# EAGLE design DualMonoPSU2 (EAGLE 9.6.2)
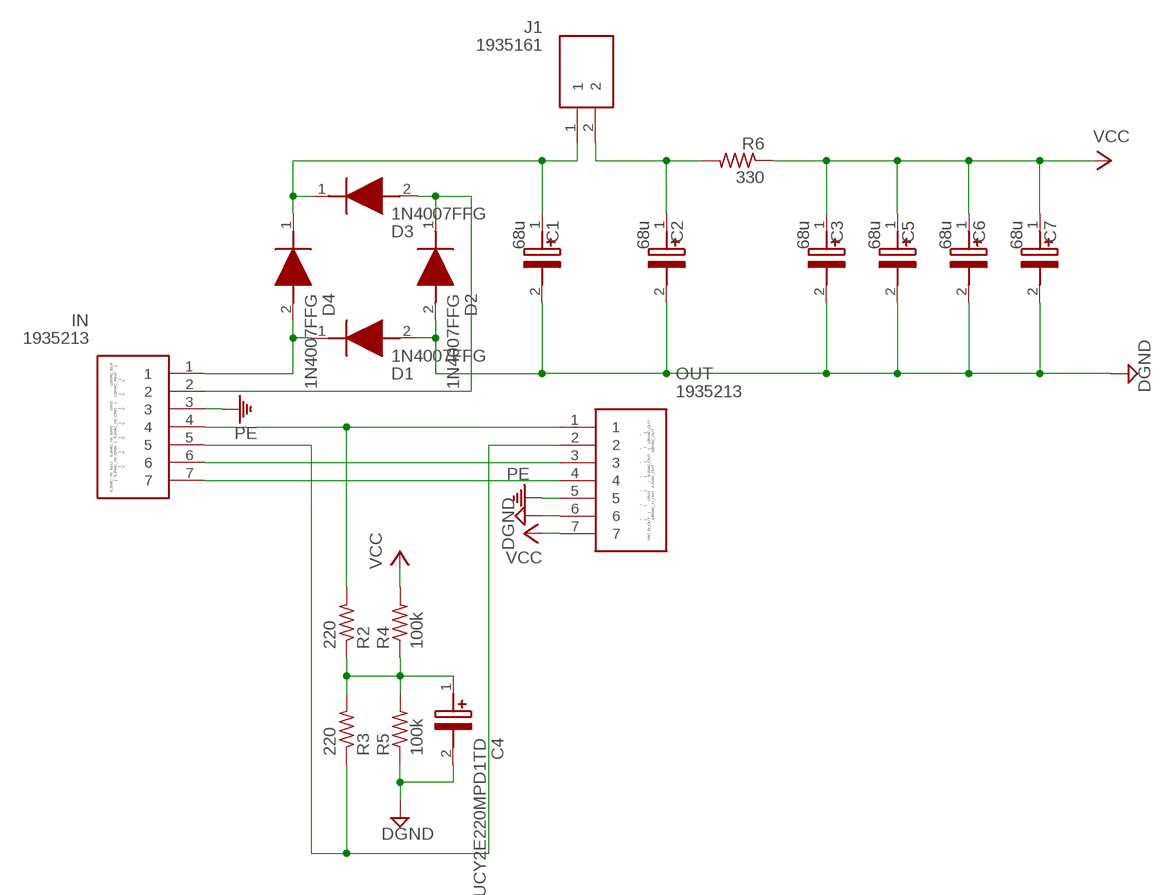
[diagram p0: schematic, sheet 1]

## Parts
C1  68u  500HXW68MEFR14.5X45  [CAPPRD750W80D1475H4700]
C2  68u  500HXW68MEFR14.5X45  [CAPPRD750W80D1475H4700]
C3  68u  500HXW68MEFR14.5X45  [CAPPRD750W80D1475H4700]
C4  UCY2E220MPD1TD  [CAPPRD500W60D1025H1750]
C5  68u  500HXW68MEFR14.5X45  [CAPPRD750W80D1475H4700]
C6  68u  500HXW68MEFR14.5X45  [CAPPRD750W80D1475H4700]
C7  68u  500HXW68MEFR14.5X45  [CAPPRD750W80D1475H4700]
D1  1N4007FFG  [DIOAD1405W86L465D235]
D2  1N4007FFG  [DIOAD1405W86L465D235]
D3  1N4007FFG  [DIOAD1405W86L465D235]
D4  1N4007FFG  [DIOAD1405W86L465D235]
IN  1935213  [1935213]
J1  1935161  [1935161]
OUT  1935213  [1935213]
R2  220  R-US_0411/15  [0411/15]
R3  220  R-US_0411/15  [0411/15]
R4  100k  R-US_0411/15  [0411/15]
R5  100k  R-US_0411/15  [0411/15]
R6  330  R-US_0411/15  [0411/15]

## Nets
DGND: C1.2(-) C2.2(-) C3.2(-) C4.2(-) C5.2(-) C6.2(-) C7.2(-) D1.2(A) D2.2(A) OUT.6 R5.1
N$1: IN.5 OUT.2 R3.1
N$2: D1.1(K) D4.2(A) IN.1
N$3: C1.1(+) D3.1(K) D4.1(K) J1.1
N$4: D2.1(K) D3.2(A) IN.2
N$5: C2.1(+) J1.2 R6.2
N$6: C4.1(+) R2.1 R3.2 R4.1 R5.2
N$7: IN.4 OUT.1 R2.2
N$8: IN.6 OUT.3
N$9: IN.7 OUT.4
PE: IN.3 OUT.5
VCC: C3.1(+) C5.1(+) C6.1(+) C7.1(+) OUT.7 R4.2 R6.1

## Notes on the sheet
- 6.3VAC_IN_BLU     6.3VAC_IN_BRN               GND               115VAC_BLK
          |   6.3VAC_IN_GRN   |   6.3VAC_IN_ORG    |     115VAC_RED      |
          |             |             |             |             |             |             |
         V            V            V            V            V            V           V
- ^             ^            ^            ^            ^            ^            ^
          |             |             |             |             |             |             |
  VAC_N_OUT    |           GND         |    6.3VAC_OUT    |    126VAC_OUT
              240VAC_H_OUT   6.3VAC_OUT            126VAC_OUT

## Library data of the parts
C1-C3 C5-C7 = 500HXW68MEFR14.5X45:500HXW68MEFR14.5X45: Aluminum Electrolytic Capacitors - Radial Leaded GENERAL PURPOSE ELECTROLYTIC CAPACITORS Source: Datasheet <https://www.mouser.com/datasheet/2/977/e_HXW-1600623.pdf>; DESCRIPTION: Aluminum Electrolytic Capacitors - Radial Leaded GENERAL PURPOSE ELECTROLYTIC CAPACITORS; HEIGHT: 47mm; MANUFACTURER_NAME: Rubycon; MANUFACTURER_PART_NUMBER: 500HXW68MEFR14.5X45
C4 = UCY2E220MPD1TD:UCY2E220MPD1TD: Aluminum Electrolytic Capacitors - Radial Leaded 22uF 250V 20% AEC-Q200 Source: Datasheet <https://www.mouser.in/datasheet/2/293/e_ucy-3082387.pdf>; DESCRIPTION: Aluminum Electrolytic Capacitors - Radial Leaded 22uF 250V 20% AEC-Q200; HEIGHT: 17.5mm; MANUFACTURER_NAME: Nichicon; MANUFACTURER_PART_NUMBER: UCY2E220MPD1TD; MOUSER_PART_NUMBER: 647-UCY2E220MPD1TD; MOUSER_PRICE-STOCK: https://www.mouser.co.uk/ProductDetail/Nichicon/UCY2E220MPD1TD?qs=JgOBn5pVFooNXIGMeLbPFg%3D%3D
D1-D4 = 1N4007FFG:1N4007FFG: Rectifiers 1000V 1A Standard Source: Datasheet <http://www.onsemi.com/pub_link/Collateral/1N4001-D.PDF>; DESCRIPTION: Rectifiers 1000V 1A Standard; HEIGHT: mm; MANUFACTURER_NAME: onsemi; MANUFACTURER_PART_NUMBER: 1N4007FFG; MOUSER_PART_NUMBER: 863-1N4007FFG; MOUSER_PRICE-STOCK: https://www.mouser.co.uk/ProductDetail/onsemi/1N4007FFG?qs=y2kkmE52mdPFE87Rxbyfgw%3D%3D
IN OUT = 1935213:1935213: Fixed Terminal Blocks PT 1.5/7-5.0-H Source: Datasheet <https://datasheet.datasheetarchive.com/originals/distributors/SFDatasheet-2/sf-00057464.pdf>; DESCRIPTION: Fixed Terminal Blocks PT 1.5/7-5.0-H; HEIGHT: 11.55mm; MANUFACTURER_NAME: Phoenix Contact; MANUFACTURER_PART_NUMBER: 1935213; MOUSER_PART_NUMBER: 651-1935213; MOUSER_PRICE-STOCK: https://www.mouser.co.uk/ProductDetail/Phoenix-Contact/1935213?qs=wd%252Bw3mUqFrnK4kINj%2Fk1Qg%3D%3D
J1 = 1935161:1935161: Phoenix Contact COMBICON PT PCB Terminal Block, 2 Way/Pole, Screw Terminals, 26 14 AWG Through Hole, Nylon Source: Datasheet <https://datasheet.datasheetarchive.com/originals/distributors/SFDatasheet-2/sf-00057459.pdf>; DESCRIPTION: Phoenix Contact COMBICON PT PCB Terminal Block, 2 Way/Pole, Screw Terminals, 26 14 AWG Through Hole, Nylon; HEIGHT: 11.55mm; MANUFACTURER_NAME: Phoenix Contact; MANUFACTURER_PART_NUMBER: 1935161; MOUSER_PART_NUMBER: 651-1935161; MOUSER_PRICE-STOCK: https://www.mouser.co.uk/ProductDetail/Phoenix-Contact/1935161?qs=W3wJikR1%252BS6eKzfFl8Rbew%3D%3D
R2-R6 = rcl:R-US_: RESISTOR, American symbol; SPICEPREFIX: R

## Net classes
3 Power: width 1.27 mm, drill 1.27 mm, clearance 0.254 mm

## Board
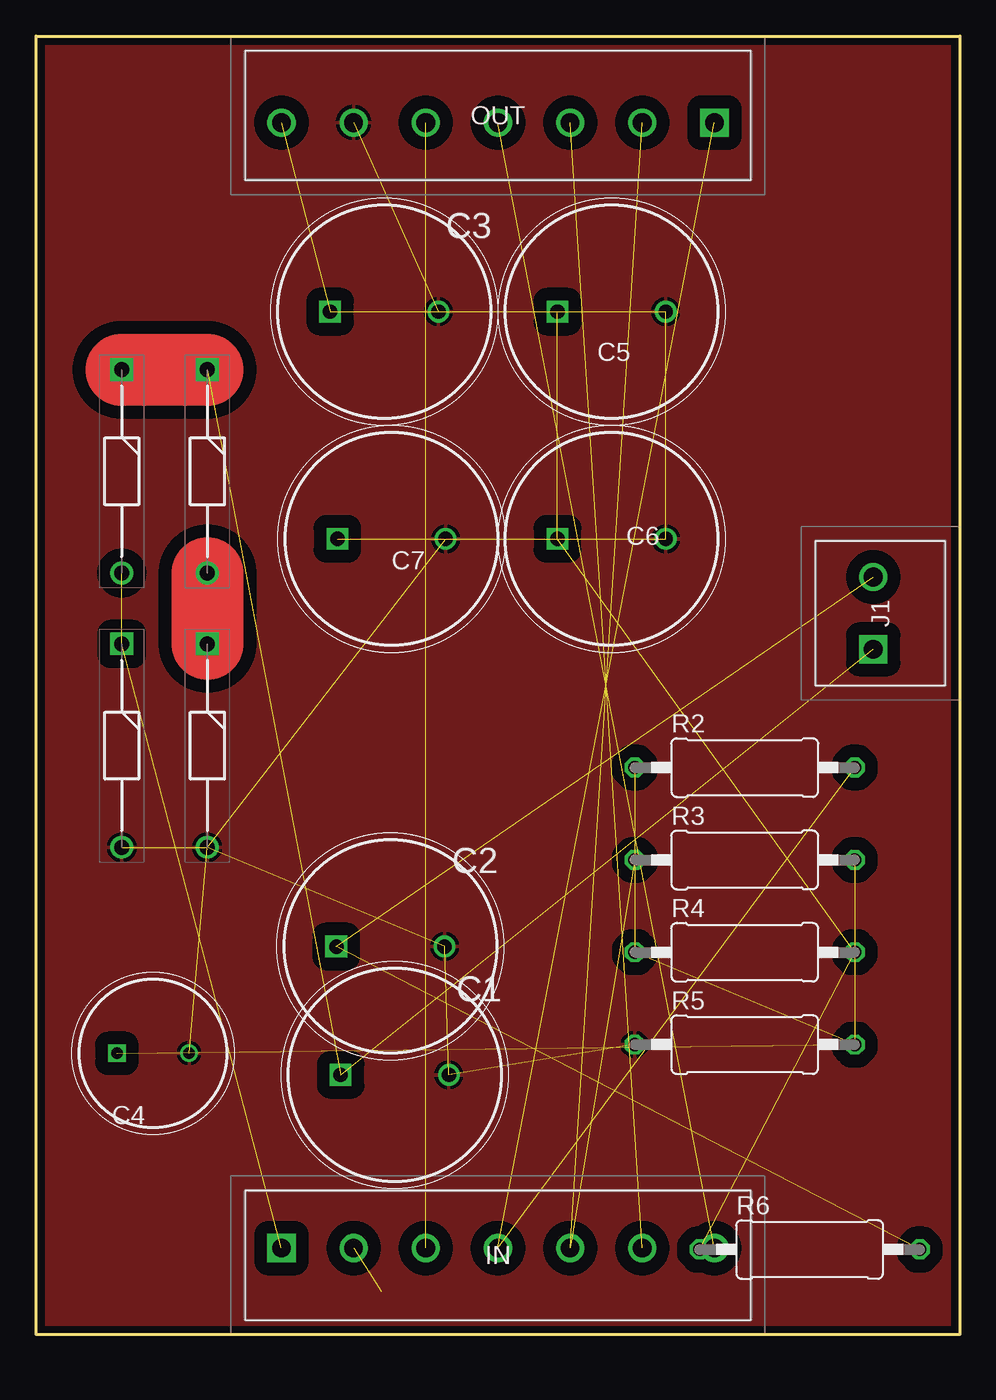
[diagram p1: board, top side]
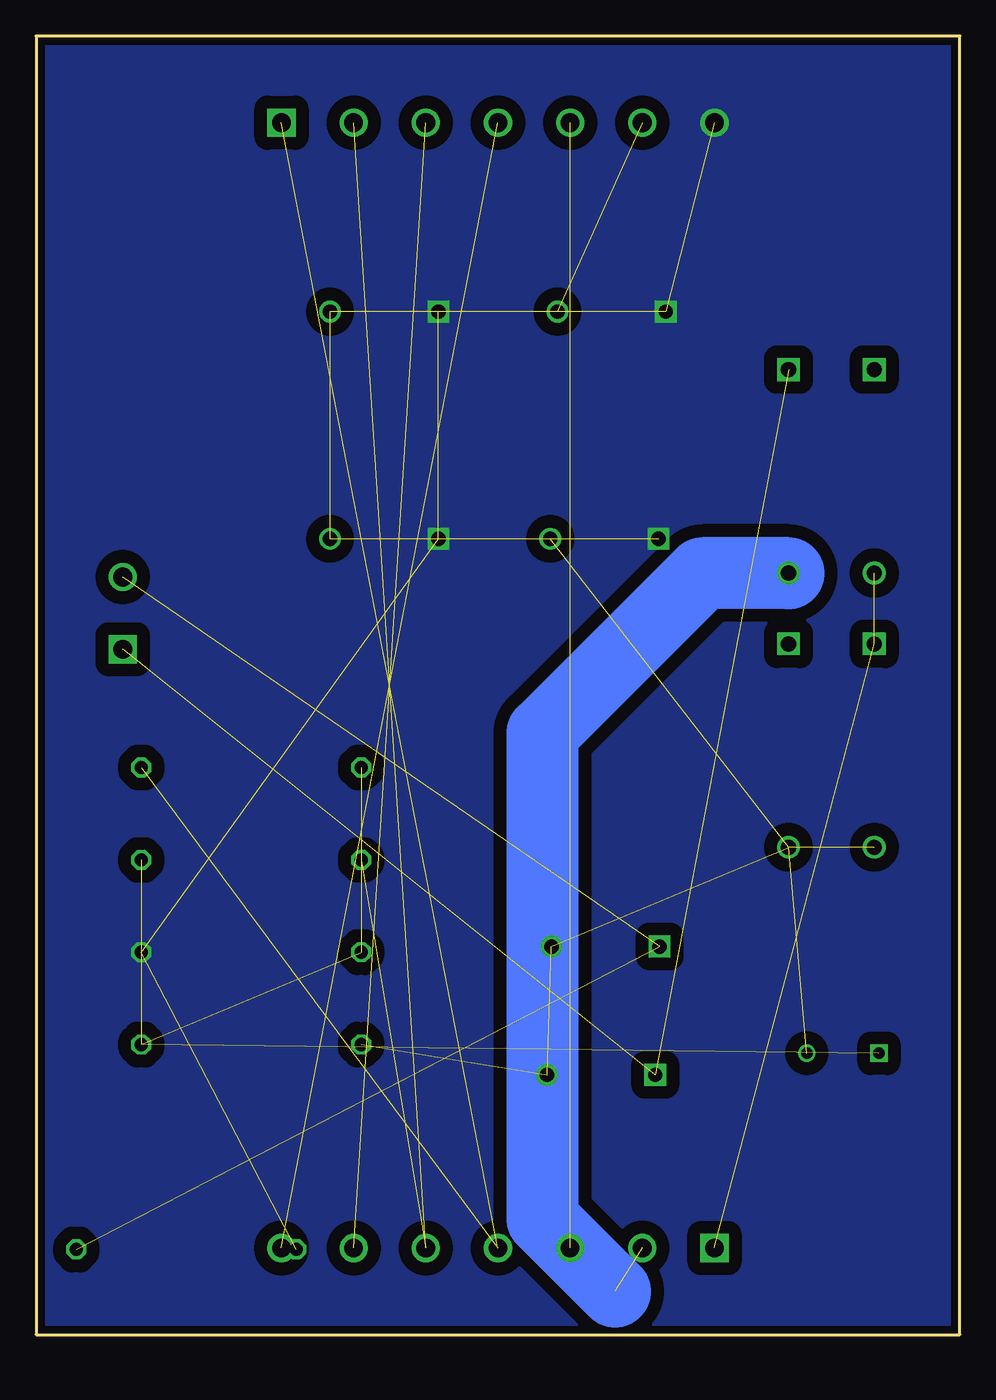
[diagram p2: board, bottom side, seen from below]

Size 64 x 90 mm. Coordinates in mm from the lower left corner, seen from the top.
Outline: 0,0 0,90 64,90 64,0 0,0
Copper layers (1*16): Top 0.035mm / dielectric 1.6mm / Bottom 0.035mm
Design rules "Elecrow_2-layer_PCB_eagle_rule *": minimum track width 5mm, minimum drill 12mil, track to track 0.9mm, track to pad 0.9mm, pad to pad 0.9mm, via to via 0.9mm, smd to smd 0mil, copper to edge 20mil, drill to drill 10mil, minimum pad ring 6mil, minimum via ring 6mil, stop-mask expansion 0mil, vias tented up to drill 100mil, thermal gap 10mil

### Footprints (pad centres in the part's own frame; a part is rotated, then mirrored left to right if it is on the bottom)
CAPPRD750W80D1475H4700 = drill 1 pad 1.5 square: 1 0,0 | drill 1 pad 1.5: 2 7.5,0
CAPPRD500W60D1025H1750 = drill 0.8 pad 1.2 square: 1 0,0 | drill 0.8 pad 1.2: 2 5,0
DIOAD1405W86L465D235 = drill 1.05 pad 1.575 square: 1 0,0 | drill 1.05 pad 1.575: 2 14.1,0
1935213 = drill 1.3 pad 1.95 square: 1 0,0 | drill 1.3 pad 1.95: 2 5,0; 3 10,0; 4 15,0; 5 20,0; 6 25,0; 7 30,0
1935161 = drill 1.3 pad 1.95 square: 1 0,0 | drill 1.3 pad 1.95: 2 5,0
0411/15 = drill 0.914 octagon: 1 -7.62,0; 2 7.62,0

### Placement (x,y rotation side)
C1  21.1,18 0 top
C2  20.8,26.9 0 top
C3  20.38,70.9 0 top
C4  5.6,19.5 0 top
C5  36.12,70.9 0 top
C6  36.12,55.15 0 top
C7  20.88,55.15 0 top
D1  5.93,47.87 270 top
D2  11.87,47.87 270 top
D3  11.87,66.88 270 top
D4  5.93,66.88 270 top
IN  17,6 0 top
J1  58,47.5 90 top
OUT  47,84 180 top
R2  49.1,39.3 0 top
R3  49.1,32.9 0 top
R4  49.1,26.5 0 top
R5  49.1,20.1 0 top
R6  53.6,5.9 0 top

### Tracks (layer width: path | path; a pad name or v marks a point on that pad's centre or on a via)
DGND  (10 unrouted)
  pour Top (rank 6): 64,0 0,0 0,90 64,90
N$1  (2 unrouted)
N$2  (2 unrouted)
N$3  (2 unrouted)
  Top 5: D4.1 D3.1
N$4  (1 unrouted)
  Top 5: D3.2 D2.1
  Bottom 5: D3.2 17.82,52.78 28.9,41.7 28.9,8 23.9,3
N$5  (2 unrouted)
N$6  (4 unrouted)
N$7  (2 unrouted)
N$8  (1 unrouted)
N$9  (1 unrouted)
PE  (1 unrouted)
VCC  (6 unrouted)
  pour Bottom (rank 6, no thermals): 64,0 0,0 0,90 64,90